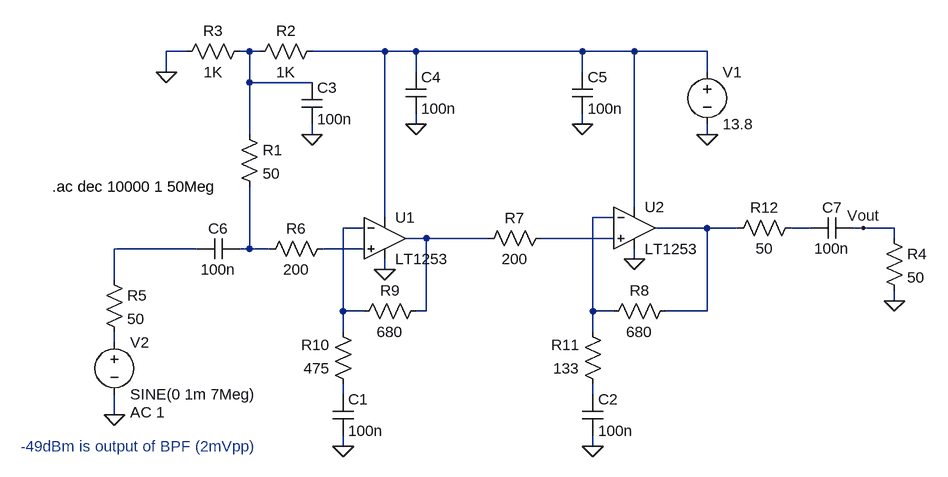
[diagram p0: schematic LT1253 RF Amp.asc]
LT1253 RF Amp.asc, the LTspice schematic file:
Version 4
SHEET 1 988 680
WIRE -192 -128 -224 -128
WIRE -96 -128 -112 -128
WIRE -80 -128 -96 -128
WIRE 112 -128 0 -128
WIRE 160 -128 112 -128
WIRE 416 -128 160 -128
WIRE 496 -128 416 -128
WIRE 608 -128 496 -128
WIRE -224 -96 -224 -128
WIRE 160 -96 160 -128
WIRE 416 -96 416 -128
WIRE 608 -96 608 -128
WIRE -96 -80 -96 -128
WIRE 0 -80 -96 -80
WIRE 160 -16 160 -32
WIRE 416 -16 416 -32
WIRE -96 0 -96 -80
WIRE 0 0 0 -16
WIRE 608 0 608 -16
WIRE 496 112 496 -128
WIRE 112 128 112 -128
WIRE 464 128 432 128
WIRE 80 144 48 144
WIRE 608 144 528 144
WIRE 656 144 608 144
WIRE 768 144 736 144
WIRE 848 144 832 144
WIRE 896 144 848 144
WIRE 176 160 144 160
WIRE 272 160 176 160
WIRE 464 160 352 160
WIRE 896 160 896 144
WIRE -176 176 -304 176
WIRE -96 176 -96 80
WIRE -96 176 -112 176
WIRE -64 176 -96 176
WIRE 80 176 16 176
WIRE 496 192 496 176
WIRE 112 208 112 192
WIRE -304 224 -304 176
WIRE 896 256 896 240
WIRE 48 272 48 144
WIRE 80 272 48 272
WIRE 176 272 176 160
WIRE 176 272 160 272
WIRE 432 272 432 128
WIRE 464 272 432 272
WIRE 608 272 608 144
WIRE 608 272 544 272
WIRE 48 304 48 272
WIRE 432 304 432 272
WIRE -304 320 -304 304
WIRE 48 400 48 384
WIRE 432 400 432 384
WIRE -304 432 -304 400
WIRE 48 480 48 464
WIRE 432 480 432 464
FLAG 160 -16 0
FLAG 0 0 0
FLAG 112 208 0
FLAG 496 192 0
FLAG 432 480 0
FLAG -304 432 0
FLAG 416 -16 0
FLAG 608 0 0
FLAG -224 -96 0
FLAG 48 480 0
FLAG 896 256 0
FLAG 848 144 Vout
SYMBOL Opamps\\LT1253 112 96 R0
SYMATTR InstName U1
SYMBOL Opamps\\LT1253 496 80 R0
SYMATTR InstName U2
SYMBOL voltage 608 -112 R0
WINDOW 123 0 0 Left 2
WINDOW 39 0 0 Left 2
SYMATTR InstName V1
SYMATTR Value 13.8
SYMBOL voltage -304 304 R0
WINDOW 123 24 124 Left 2
WINDOW 39 0 0 Left 2
SYMATTR Value2 AC 1
SYMATTR InstName V2
SYMATTR Value SINE(0 1m 7Meg)
SYMBOL res -112 -16 R0
SYMATTR InstName R1
SYMATTR Value 50
SYMBOL res 16 -144 R90
WINDOW 0 0 56 VBottom 2
WINDOW 3 32 56 VTop 2
SYMATTR InstName R2
SYMATTR Value 1K
SYMBOL res -96 -144 R90
WINDOW 0 0 56 VBottom 2
WINDOW 3 32 56 VTop 2
SYMATTR InstName R3
SYMATTR Value 1K
SYMBOL res 32 160 R90
WINDOW 0 0 56 VBottom 2
WINDOW 3 32 56 VTop 2
SYMATTR InstName R6
SYMATTR Value 200
SYMBOL res 368 144 R90
WINDOW 0 0 56 VBottom 2
WINDOW 3 32 56 VTop 2
SYMATTR InstName R7
SYMATTR Value 200
SYMBOL res 560 256 R90
WINDOW 0 0 56 VBottom 2
WINDOW 3 32 56 VTop 2
SYMATTR InstName R8
SYMATTR Value 680
SYMBOL res 176 256 R90
WINDOW 0 0 56 VBottom 2
WINDOW 3 32 56 VTop 2
SYMATTR InstName R9
SYMATTR Value 680
SYMBOL res 64 400 R180
WINDOW 0 36 76 Left 2
WINDOW 3 36 40 Left 2
SYMATTR InstName R10
SYMATTR Value 475
SYMBOL res 448 400 R180
WINDOW 0 36 76 Left 2
WINDOW 3 36 40 Left 2
SYMATTR InstName R11
SYMATTR Value 133
SYMBOL cap 32 400 R0
SYMATTR InstName C1
SYMATTR Value 100n
SYMBOL cap 416 400 R0
SYMATTR InstName C2
SYMATTR Value 100n
SYMBOL cap -16 -80 R0
SYMATTR InstName C3
SYMATTR Value 100n
SYMBOL cap 144 -96 R0
SYMATTR InstName C4
SYMATTR Value 100n
SYMBOL cap 400 -96 R0
SYMATTR InstName C5
SYMATTR Value 100n
SYMBOL cap -112 160 R90
WINDOW 0 0 32 VBottom 2
WINDOW 3 32 32 VTop 2
SYMATTR InstName C6
SYMATTR Value 100n
SYMBOL res 880 144 R0
SYMATTR InstName R4
SYMATTR Value 50
SYMBOL res -320 208 R0
SYMATTR InstName R5
SYMATTR Value 50
SYMBOL cap 832 128 R90
WINDOW 0 0 32 VBottom 2
WINDOW 3 32 32 VTop 2
SYMATTR InstName C7
SYMATTR Value 100n
SYMBOL res 752 128 R90
WINDOW 0 0 56 VBottom 2
WINDOW 3 32 56 VTop 2
SYMATTR InstName R12
SYMATTR Value 50
TEXT -400 80 Left 2 !.ac dec 10000 1 50Meg
TEXT -448 480 Left 2 ;-49dBm is output of BPF (2mVpp)

The netlist it stands for:
* LT1253 RF Amp.asc
XU1 N011 N004 N002 0 N007 LT1253  ; pins In+ In- V+ V- OUT
XU2 N008 N003 N002 0 N005 LT1253  ; pins In+ In- V+ V- OUT
V1 N002 0 13.8
V2 N012 0 SINE(0 1m 7Meg) AC 1
R1 N001 N010 50
R2 N002 N001 1K
R3 N001 0 1K
R6 N011 N010 200
R7 N008 N007 200
R8 N005 N003 680
R9 N007 N004 680
R10 N013 N004 475
R11 N014 N003 133
C1 N013 0 100n
C2 N014 0 100n
C3 N001 0 100n
C4 N002 0 100n
C5 N002 0 100n
C6 N010 N009 100n
R4 Vout 0 50
R5 N009 N012 50
C7 Vout N006 100n
R12 N006 N005 50
.ac dec 10000 1 50Meg
* -49dBm is output of BPF (2mVpp)
.backanno
.end